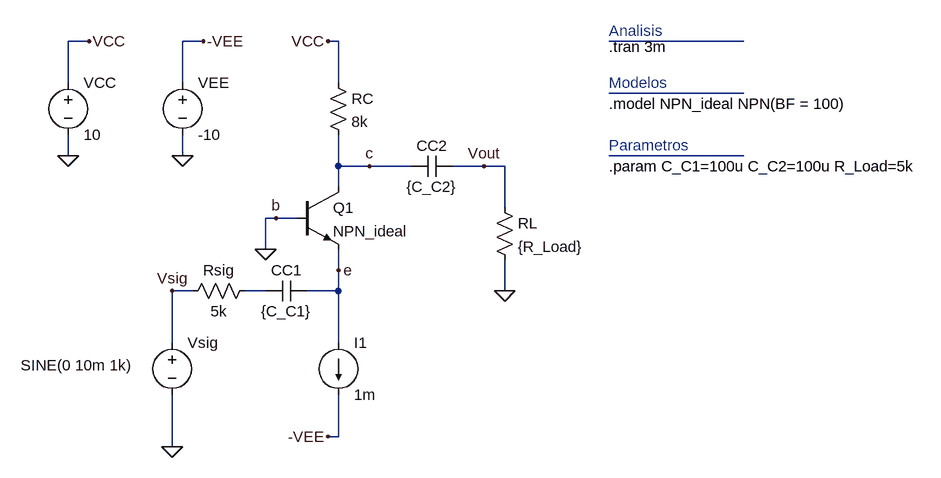
[diagram p0: schematic bjt_cb_time.asc]
bjt_cb_time.asc, the LTspice schematic file:
Version 4
SHEET 1 916 680
WIRE -560 -256 -592 -256
WIRE -384 -256 -416 -256
WIRE -176 -256 -192 -256
WIRE 448 -256 240 -256
WIRE -592 -192 -592 -256
WIRE -416 -192 -416 -256
WIRE -176 -192 -176 -256
WIRE 448 -176 240 -176
WIRE -592 -80 -592 -112
WIRE -416 -80 -416 -112
WIRE 448 -80 240 -80
WIRE -176 -64 -176 -112
WIRE -128 -64 -176 -64
WIRE -64 -64 -128 -64
WIRE 48 -64 0 -64
WIRE 80 -64 48 -64
WIRE -176 -32 -176 -64
WIRE 80 0 80 -64
WIRE -272 16 -288 16
WIRE -240 16 -272 16
WIRE -288 64 -288 16
WIRE -176 96 -176 64
WIRE -400 128 -432 128
WIRE -288 128 -320 128
WIRE -176 128 -176 96
WIRE -176 128 -224 128
WIRE 80 128 80 80
WIRE -432 208 -432 128
WIRE -176 208 -176 128
WIRE -176 352 -176 288
WIRE -176 352 -192 352
WIRE -432 368 -432 288
FLAG -592 -80 0
FLAG -560 -256 VCC
FLAG -432 368 0
FLAG -192 -256 VCC
FLAG 48 -64 Vout
FLAG -192 352 -VEE
FLAG -416 -80 0
FLAG -384 -256 -VEE
FLAG 80 128 0
FLAG -432 128 Vsig
FLAG -272 16 b
FLAG -128 -64 c
FLAG -176 96 e
FLAG -288 64 0
SYMBOL npn -240 -32 R0
SYMATTR InstName Q1
SYMATTR Value NPN_ideal
SYMBOL res -192 -208 R0
SYMATTR InstName RC
SYMATTR Value 8k
SYMBOL voltage -592 -208 R0
WINDOW 123 0 0 Left 0
WINDOW 39 0 0 Left 0
SYMATTR InstName VCC
SYMATTR Value 10
SYMBOL voltage -432 192 R0
WINDOW 3 -233 50 Left 2
WINDOW 123 0 0 Left 0
WINDOW 39 0 0 Left 0
SYMATTR Value SINE(0 10m 1k)
SYMATTR InstName Vsig
SYMBOL current -176 208 R0
WINDOW 123 0 0 Left 0
WINDOW 39 0 0 Left 0
SYMATTR InstName I1
SYMATTR Value 1m
SYMBOL cap -224 112 R90
WINDOW 0 0 32 VBottom 2
WINDOW 3 32 32 VTop 2
SYMATTR InstName CC1
SYMATTR Value {C_C1}
SYMBOL cap 0 -80 R90
WINDOW 0 0 32 VBottom 2
WINDOW 3 32 32 VTop 2
SYMATTR InstName CC2
SYMATTR Value {C_C2}
SYMBOL res -304 112 R90
WINDOW 0 0 56 VBottom 2
WINDOW 3 32 56 VTop 2
SYMATTR InstName Rsig
SYMATTR Value 5k
SYMBOL voltage -416 -208 R0
WINDOW 123 0 0 Left 0
WINDOW 39 0 0 Left 0
SYMATTR InstName VEE
SYMATTR Value -10
SYMBOL res 64 -16 R0
SYMATTR InstName RL
SYMATTR Value {R_Load}
TEXT 240 -272 Left 2 ;Analisis
TEXT 240 -248 Left 2 !.tran 3m
TEXT 240 -160 Left 2 !.model NPN_ideal NPN(BF = 100)
TEXT 240 -192 Left 2 ;Modelos
TEXT 240 -64 Left 2 !.param C_C1=100u C_C2=100u R_Load=5k
TEXT 240 -96 Left 2 ;Parametros

The netlist it stands for:
* bjt_cb_time.asc
Q1 c 0 e 0 NPN_ideal
RC VCC c 8k
VCC VCC 0 10
Vsig Vsig 0 SINE(0 10m 1k)
I1 e -VEE 1m
CC1 e N004 {C_C1}
CC2 Vout c {C_C2}
Rsig N004 Vsig 5k
VEE -VEE 0 -10
RL Vout 0 {R_Load}
.model NPN NPN
.model PNP PNP
.lib standard.bjt
* Analisis
.tran 3m
.model NPN_ideal NPN(BF = 100)
* Modelos
.param C_C1=100u C_C2=100u R_Load=5k
* Parametros
.backanno
.end